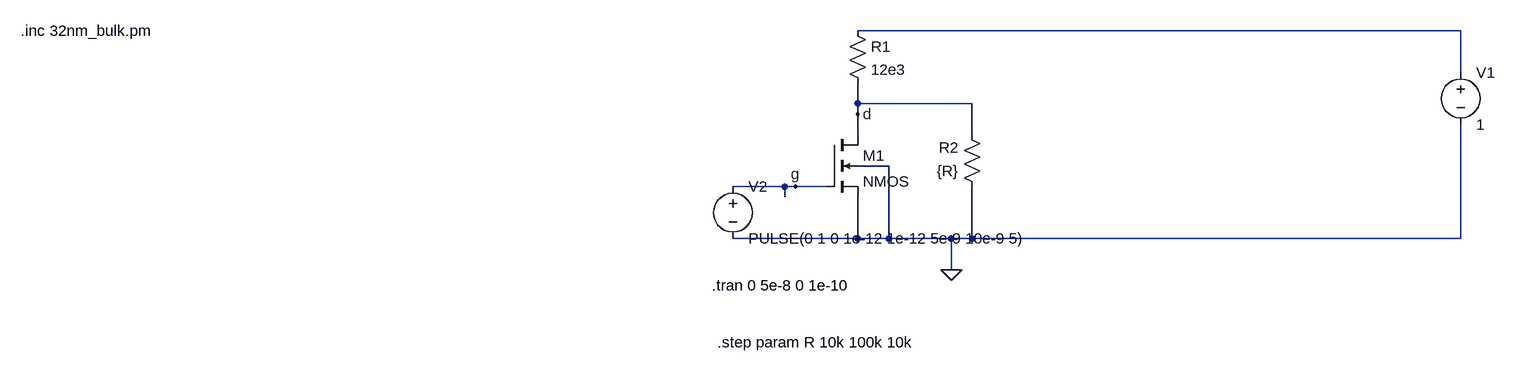
[diagram p0: schematic pulse_char.asc]
pulse_char.asc, the LTspice schematic file:
Version 4
SHEET 1 1184 680
WIRE 1120 -16 192 -16
WIRE 1120 48 1120 -16
WIRE 192 96 192 64
WIRE 368 96 192 96
WIRE 192 112 192 96
WIRE 192 144 192 112
WIRE 368 144 368 96
WIRE 240 192 192 192
WIRE 80 224 0 224
WIRE 96 224 80 224
WIRE 144 224 96 224
WIRE 80 240 80 224
WIRE 192 304 192 240
WIRE 192 304 0 304
WIRE 240 304 240 192
WIRE 240 304 192 304
WIRE 336 304 240 304
WIRE 368 304 368 224
WIRE 368 304 336 304
WIRE 1120 304 1120 128
WIRE 1120 304 368 304
WIRE 336 352 336 304
FLAG 336 352 0
FLAG 192 112 d
FLAG 96 224 g
SYMBOL res 176 -32 R0
SYMATTR InstName R1
SYMATTR Value 12e3
SYMBOL voltage 1120 32 R0
WINDOW 123 0 0 Left 0
WINDOW 39 0 0 Left 0
SYMATTR InstName V1
SYMATTR Value 1
SYMBOL voltage 0 208 R0
WINDOW 123 0 0 Left 0
WINDOW 39 0 0 Left 0
SYMATTR InstName V2
SYMATTR Value PULSE(0 1 0 1e-12 1e-12 5e-9 10e-9 5)
SYMBOL nmos4 144 144 R0
SYMATTR InstName M1
SYMATTR Value2 l=32e-9 w=320e-9 ad=51200e-18 as=51200e-18 pd=960e-9 ps=960e-9
SYMBOL res 384 240 R180
WINDOW 0 36 76 Left 2
WINDOW 3 36 40 Left 2
SYMATTR InstName R2
SYMATTR Value {R}
TEXT -32 376 Left 2 !.tran 0 5e-8 0 1e-10
TEXT -24 464 Left 2 !.step param R 10k 100k 10k
TEXT -1096 -16 Left 2 !.inc 32nm_bulk.pm

The netlist it stands for:
* pulse_char.asc
R1 N001 d 12e3
V1 N001 0 1
V2 g 0 PULSE(0 1 0 1e-12 1e-12 5e-9 10e-9 5)
M1 d g 0 0 NMOS l=32e-9 w=320e-9 ad=51200e-18 as=51200e-18 pd=960e-9 ps=960e-9
R2 0 d {R}
.model NMOS NMOS
.model PMOS PMOS
.lib standard.mos
.tran 0 5e-8 0 1e-10
.step param R 10k 100k 10k
.inc 32nm_bulk.pm
.backanno
.end

* Results of the author's LTspice run, read from the files saved beside the schematic
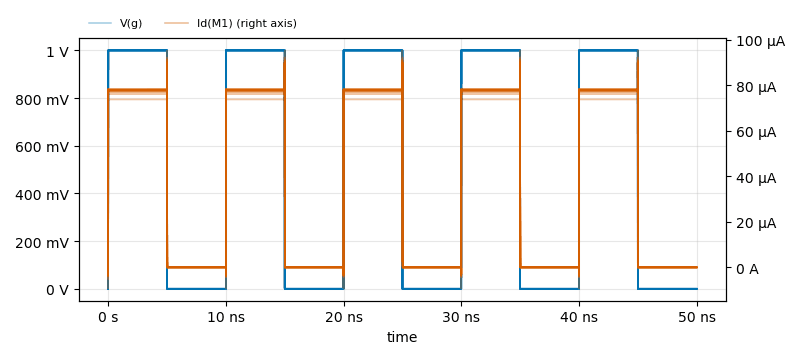
[diagram p1: Transient Analysis of pulse_char.asc, plotted from the saved traces]
* Transient Analysis, 10 runs:
*   V(g) [run 1]: min 0 V, max 1 V, average 500.1 mV, rms 707.2 mV, last 0 V
*   V(g) [run 2]: min 0 V, max 1 V, average 500.1 mV, rms 707.2 mV, last 0 V
*   V(g) [run 3]: min 0 V, max 1 V, average 500.1 mV, rms 707.2 mV, last 0 V
*   V(g) [run 4]: min 0 V, max 1 V, average 500.1 mV, rms 707.2 mV, last 0 V
*   V(g) [run 5]: min 0 V, max 1 V, average 500.1 mV, rms 707.2 mV, last 0 V
*   V(g) [run 6]: min 0 V, max 1 V, average 500.1 mV, rms 707.2 mV, last 0 V
*   V(g) [run 7]: min 0 V, max 1 V, average 500.1 mV, rms 707.2 mV, last 0 V
*   V(g) [run 8]: min 0 V, max 1 V, average 500.1 mV, rms 707.2 mV, last 0 V
*   Id(M1) [run 1]: min -9.371 µA, max 95.26 µA, average 36.9 µA, rms 52.14 µA, last 6.285 nA
*   Id(M1) [run 2]: min -5.111 µA, max 92.16 µA, average 38.11 µA, rms 53.83 µA, last 15.75 nA
*   Id(M1) [run 3]: min -4.158 µA, max 91.1 µA, average 38.53 µA, rms 54.42 µA, last 25.3 nA
*   Id(M1) [run 4]: min -3.729 µA, max 90.57 µA, average 38.75 µA, rms 54.72 µA, last 33.98 nA
*   Id(M1) [run 5]: min -3.491 µA, max 90.24 µA, average 38.88 µA, rms 54.9 µA, last 41.39 nA
*   Id(M1) [run 6]: min -3.347 µA, max 90.03 µA, average 38.97 µA, rms 55.02 µA, last 47.73 nA
*   Id(M1) [run 7]: min -3.243 µA, max 89.87 µA, average 39.04 µA, rms 55.11 µA, last 53.15 nA
*   Id(M1) [run 8]: min -3.164 µA, max 89.76 µA, average 39.09 µA, rms 55.17 µA, last 57.82 nA